# Altium schematic sheet lora.SchDoc
size A4; DocumentNumber: P23; SheetNumber: 3; SheetTotal: 5
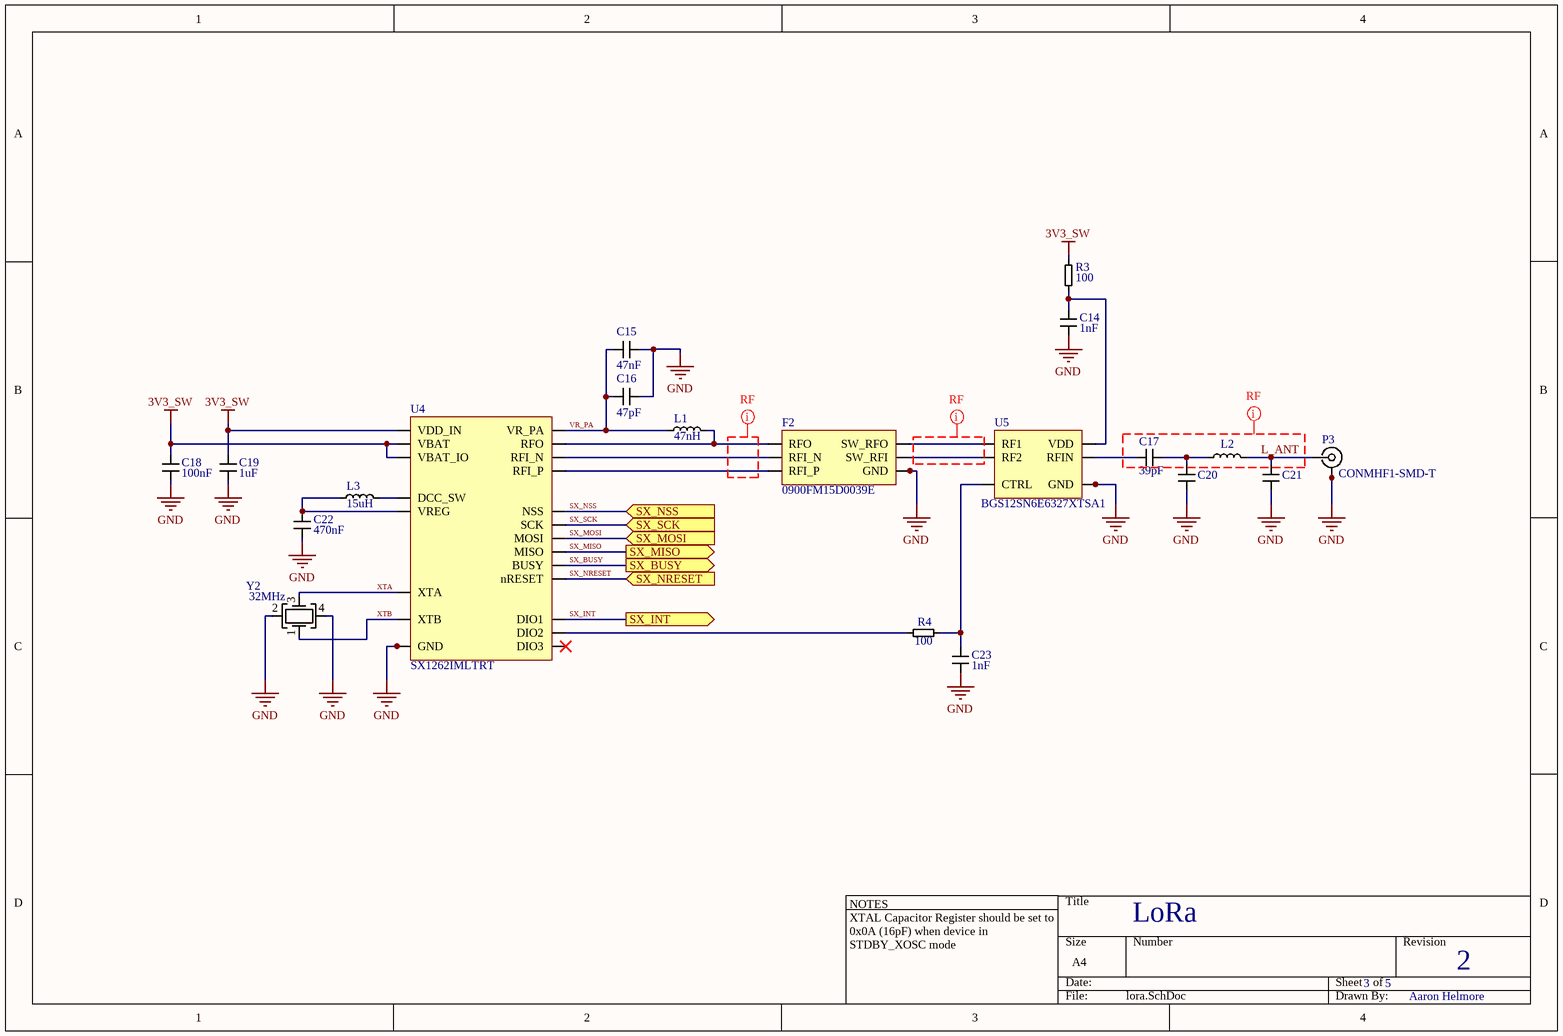
[diagram p0: lora.SchDoc]

## Parts
C14  1nF  [CAP_0402]
C15  47nF  [CAP_0402]
C16  47pF  [CAP_0402]
C17  39pF  [CAP_0402]
C18  100nF  [CAP_0402]
C19  1uF  [CAP_0402]
C20  Capacitor  [CAP_0402]  (value not drawn)
C21  Capacitor  [CAP_0402]  (value not drawn)
C22  470nF  [CAP_0603]
C23  1nF  [CAP_0402]
F2  0900FM15D0039E  [0900FM15D0039E]
L1  47nH  [LQW15AN]
L2  Inductor  [RES_0402]  (value not drawn)
L3  15uH  [VLS2010ET-150M]
P3  CONMHF1-SMD-T  [CONMHF1-SMD-T]
R3  100  [RES_0402]
R4  100  [RES_0402]
U4  SX1262IMLTRT  [SX1262IMLTRT]
U5  BGS12SN6E6327XTSA1  [BGS12SN6E6327XTSA1]
Y2  32MHz  [4-SMD]

## Ports
SX_BUSY (out), SX_INT (out), SX_MISO (out), SX_MOSI (in), SX_NRESET (in), SX_NSS (in), SX_SCK (in)

## Nets
3V3_SW: C18.2(J11) C19.1(J12) R3.1 U4.1(VDD_IN) U4.10(VBAT) U4.11(VBAT_IO)
GND: C14.1(J12) C15.1(J12) C16.1(J12) C18.1(J12) C19.2(J11) C20.1(J12) C21.1(J12) C22.1(J12) C23.1(J12) F2.2(GND) F2.5(GND) F2.7(GND) F2.9(GND) F2.10(GND) P3.2(VCC) P3.3(VCC) P3.4(VCC) U4.0(GND) U4.2(GND) U4.5(GND) U4.8(GND) U4.20(GND) U5.2(GND) Y2.2 Y2.4
L_ANT: C21.2(J11) L2.2 P3.1(VCC)
SX_BUSY: U4.14(BUSY) ; port SX_BUSY
SX_INT: U4.13(DIO1) ; port SX_INT
SX_MISO: U4.16(MISO) ; port SX_MISO
SX_MOSI: U4.17(MOSI) ; port SX_MOSI
SX_NRESET: U4.15(nRESET) ; port SX_NRESET
SX_NSS: U4.19(NSS) ; port SX_NSS
SX_SCK: U4.18(SCK) ; port SX_SCK
VR_PA: C15.2(J11) C16.2(J11) L1.1 U4.24(VR_PA)
XTA: U4.3(XTA) Y2.3
XTB: U4.4(XTB) Y2.1
NetC14_2: C14.2(J11) R3.2 U5.4(VDD)
NetC17_1: C17.1(J12) U5.5(RFIN)
NetC17_2: C17.2(J11) C20.2(J11) L2.1
NetC22_2: C22.2(J11) L3.1 U4.7(VREG)
NetC23_2: C23.2(J11) R4.2 U5.6(CTRL)
NetF2_1: F2.1(RFO) L1.2 U4.23(RFO)
NetF2_3: F2.3(RFI_N) U4.22(RFI_N)
NetF2_4: F2.4(RFI_P) U4.21(RFI_P)
NetF2_6: F2.6(SW_RFI) U5.1(RF2)
NetF2_8: F2.8(SW_RFO) U5.3(RF1)
NetL3_2: L3.2 U4.9(DCC_SW)
NetR4_1: R4.1 U4.12(DIO2)

Not connected (* = marked no-connect by the designer): U4 6(DIO3)*

## Layout directives
rule Impedance Constraint [Min = 49.50    Max = 50.50    ]; net class SX_RF_LINES: (no net found under the mark), L_ANT

## Notes on the sheet
- NOTES
  XTAL Capacitor Register should be set to 0x0A (16pF) when device in STDBY_XOSC mode
- LoRa
- 3
- 5
- 2
- Aaron Helmore

## Library data of the parts
C14 C23 = Capacitor: Dielectric: X7R; Voltage: 50V
C15 C22 = Capacitor: Dielectric: X7R; Voltage: 25V
C16 C17 = Capacitor: Dielectric: C0G; Voltage: 50V
C18 C19 = Capacitor: Dielectric: X5R; Voltage: 25V
F2 = 0900FM15D0039E: Miniature impedance-matched filter for Semtech SX1261/SX1262 for 915MHz operation
L1 L3 = Inductor
R3 R4 = R_Small: Tolerance: 1%; Wattage: 1/4W
U4 = SX1262IMLTRT: Semtech LoRa radio transceivers
Y2 = Crystal_2_2